# EAGLE design 3_main_a (EAGLE 6.4)
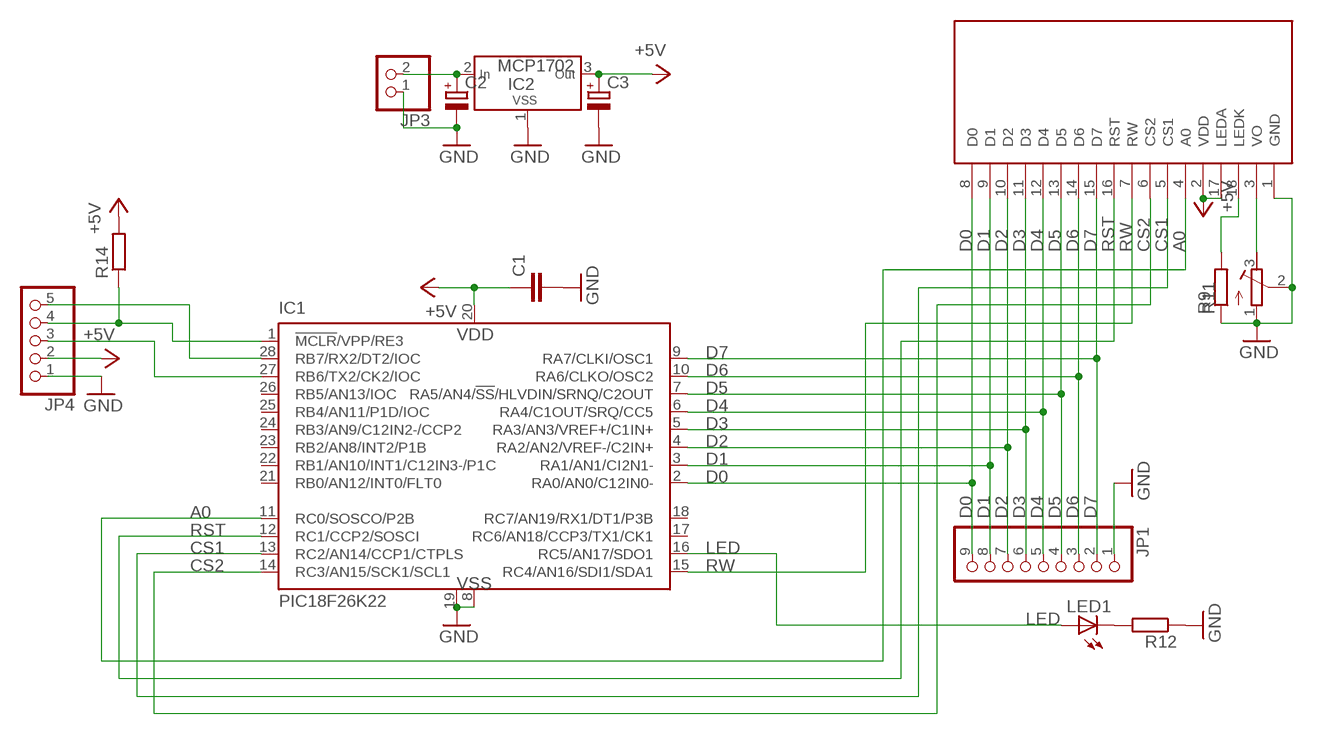
[diagram p0: schematic, sheet 1]

## Parts
C1  C-EU025-025X050  [C025-025X050]
C2  CPOL-EUE2-4  [E2-4]
C3  CPOL-EUE2-4  [E2-4]
IC1  PIC18F26K22  [DIL28-3]
IC2  MCP1702  [TO-92]
JP1  PINHD-1X09_2.54-90°  [1X09/90]
JP3  PINHD-1X2  [1X02]
JP4  PINHD-1X05_2.54-90°  [1X05/90]
LCD1  DEM122032  [DEM122032]
LED1  LED3MM  [LED3MM]
R9  R_0207  [R_0207_BIGPADS]
R11  R-TRIMM3339P  [RTRIM3339P]
R12  R_0207  [R_0207_BIGPADS]
R14  R_0207  [R_0207_BIGPADS]

## Nets
+5V: C1.1 C3.+ IC1.20(VDD) IC2.3(OUT) JP4.2 LCD1.2(VDD) LCD1.17(LEDA) R14.P$2
A0: IC1.11(RC0/SOSCO/P2B) LCD1.4(A0)
CS1: IC1.13(RC2/AN14/CCP1/CTPLS) LCD1.5(CS1)
CS2: IC1.14(RC3/AN15/SCK1/SCL1) LCD1.6(CS2)
D0: IC1.2(RA0/AN0/C12IN0-) JP1.9 LCD1.8(D0)
D1: IC1.3(RA1/AN1/CI2N1-) JP1.8 LCD1.9(D1)
D2: IC1.4(RA2/AN2/VREF-/C2IN+) JP1.7 LCD1.10(D2)
D3: IC1.5(RA3/AN3/VREF+/C1IN+) JP1.6 LCD1.11(D3)
D4: IC1.6(RA4/C1OUT/SRQ/CC5) JP1.5 LCD1.12(D4)
D5: IC1.7(RA5/AN4/!SS!/HLVDIN/SRNQ/C2OUT) JP1.4 LCD1.13(D5)
D6: IC1.10(RA6/CLKO/OSC2) JP1.3 LCD1.14(D6)
D7: IC1.9(RA7/CLKI/OSC1) JP1.2 LCD1.15(D7)
GND: C1.2 C2.- C3.- IC1.8(VSS) IC1.19(VSS) IC2.1(VSS) JP1.1 JP3.1 JP4.1 LCD1.1(GND) R9.P$1 R11.1(E) R11.2(S) R12.P$1
LED: IC1.16(RC5/AN17/SDO1) LED1.A
N$36: LCD1.18(LEDK) R9.P$2
N$37: LCD1.3(VO) R11.3(A)
N$40: LED1.K(C) R12.P$2
N$44: C2.+ IC2.2(IN) JP3.2
N$47: IC1.1(!MCLR!/VPP/RE3) JP4.4 R14.P$1
N$48: IC1.28(RB7/RX2/DT2/IOC) JP4.5
N$49: IC1.27(RB6/TX2/CK2/IOC) JP4.3
RST: IC1.12(RC1/CCP2/SOSCI) LCD1.16(RST)
RW: IC1.15(RC4/AN16/SDI1/SDA1) LCD1.7(RW)
Unconnected: IC1.17(RC6/AN18/CCP3/TX1/CK1) IC1.18(RC7/AN19/RX1/DT1/P3B) IC1.21(RB0/AN12/INT0/FLT0) IC1.22(RB1/AN10/INT1/C12IN3-/P1C) IC1.23(RB2/AN8/INT2/P1B) IC1.24(RB3/AN9/C12IN2-/CCP2) IC1.25(RB4/AN11/P1D/IOC) IC1.26(RB5/AN13/IOC)

## Library data of the parts
C1 = _rcl:C-EU: CAPACITOR, European symbol
C2 C3 = _rcl:CPOL-EU: POLARIZED CAPACITOR, European symbol
IC1 = _mcom5:PIC18F26K22
IC2 = _mcom5:MCP1702
JP1 = pinhead-2:PINHD-1X09: PIN HEADER
JP3 = pinhead:PINHD-1X2: PIN HEADER
JP4 = pinhead-2:PINHD-1X05: PIN HEADER
LCD1 = _mcom6:DEM122032
LED1 = led:LED: LED OSRAM: - CHIPLED LG R971, LG N971, LY N971, LG Q971, LY Q971, LO R971, LY R971 LH N974, LH R974 LS Q976, LO Q976, LY Q976 LO Q996 - Hyper CHIPLED LW Q18S LB Q993, LB Q99A, LB R99A - SideLED LS A670, LO A670, LY A670, LG A670, LP A670 LB A673, LV A673, LT A673, LW A673 LH A674 LY A675 LS A676, LA A676, LO A676, LY A676, LW A676 LS A679, LY A679, LG A679 - Hyper Micro SIDELED® LS Y876, LA Y876, LO Y876, LY Y876 LT Y87S - SmartLED LW L88C, LW L88S LB L89C, LB L89S, LG L890 LS L89K, LO L89K, LY L89K LS L896, LA L896, LO L896, LY L896 - TOPLED LS T670, LO T670, LY T670, LG T670, LP T670 LSG T670, LSP T670, LSY T670, LOP T670, LYG T670 LG T671, LOG T671, LSG T671 LB T673, LV T673, LT T673, LW T673 LH T674 LS T676, LA T676, LO T676, LY T676, LB T676, LH T676, LSB T676, LW T676 LB T67C, LV T67C, LT T67C, LS T67K, LO T67K, LY T67K, LW E67C LS E67B, LA E67B, LO E67B, LY E67B, LB E67C, LV E67C, LT E67C LW T67C LS T679, LY T679, LG T679 LS T770, LO T770, LY T770, LG T770, LP T770 LB T773, LV T773, LT T773, LW T773 LH T774 LS E675, LA E675, LY E675, LS T675 LS T776, LA T776, LO T776, LY T776, LB T776 LHGB T686 LT T68C, LB T68C - Hyper Mini TOPLED® LB M676 - Mini TOPLED Santana® LG M470 LS M47K, LO M47K, LY M47K Source: http://www.osram.convergy.de LUXEON: - LUMILED® LXK2-PW12-R00, LXK2-PW12-S00, LXK2-PW14-U00, LXK2-PW14-V00 LXK2-PM12-R00, LXK2-PM12-S00, LXK2-PM14-U00 LXK2-PE12-Q00, LXK2-PE12-R00, LXK2-PE12-S00, LXK2-PE14-T00, LXK2-PE14-U00 LXK2-PB12-K00, LXK2-PB12-L00, LXK2-PB12-M00, LXK2-PB14-N00, LXK2-PB14-P00, LXK2-PB14-Q00 LXK2-PR12-L00, LXK2-PR12-M00, LXK2-PR14-Q00, LXK2-PR14-R00 LXK2-PD12-Q00, LXK2-PD12-R00, LXK2-PD12-S00 LXK2-PH12-R00, LXK2-PH12-S00 LXK2-PL12-P00, LXK2-PL12-Q00, LXK2-PL12-R00 Source: www.luxeon.com KINGBRIGHT: KA-3528ASYC Source: www.kingbright.com
R9 R12 R14 = _moja:R
R11 = _rcl:R-TRIMM: Trimm resistor

## Board
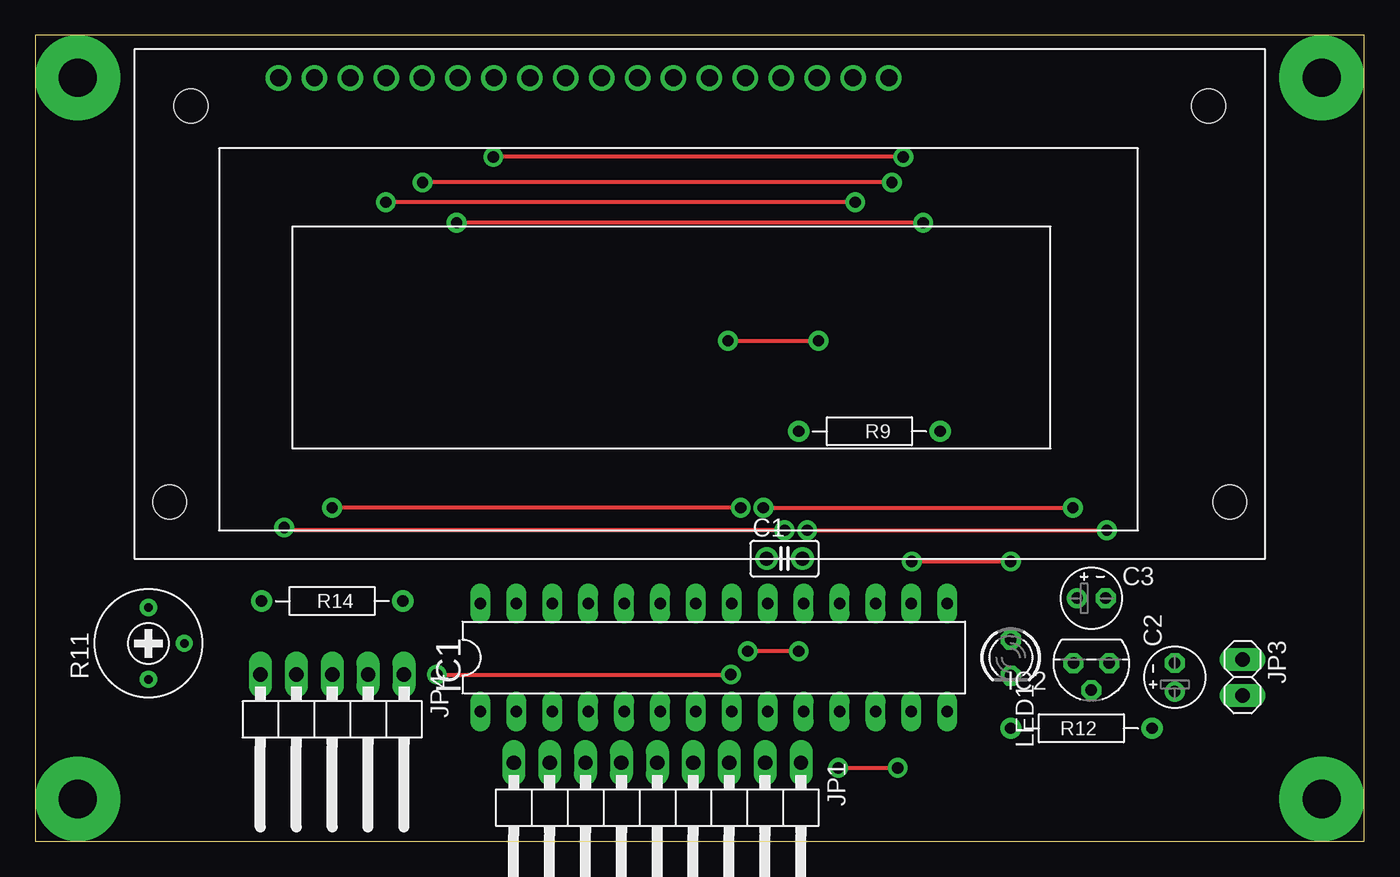
[diagram p1: board, top side]
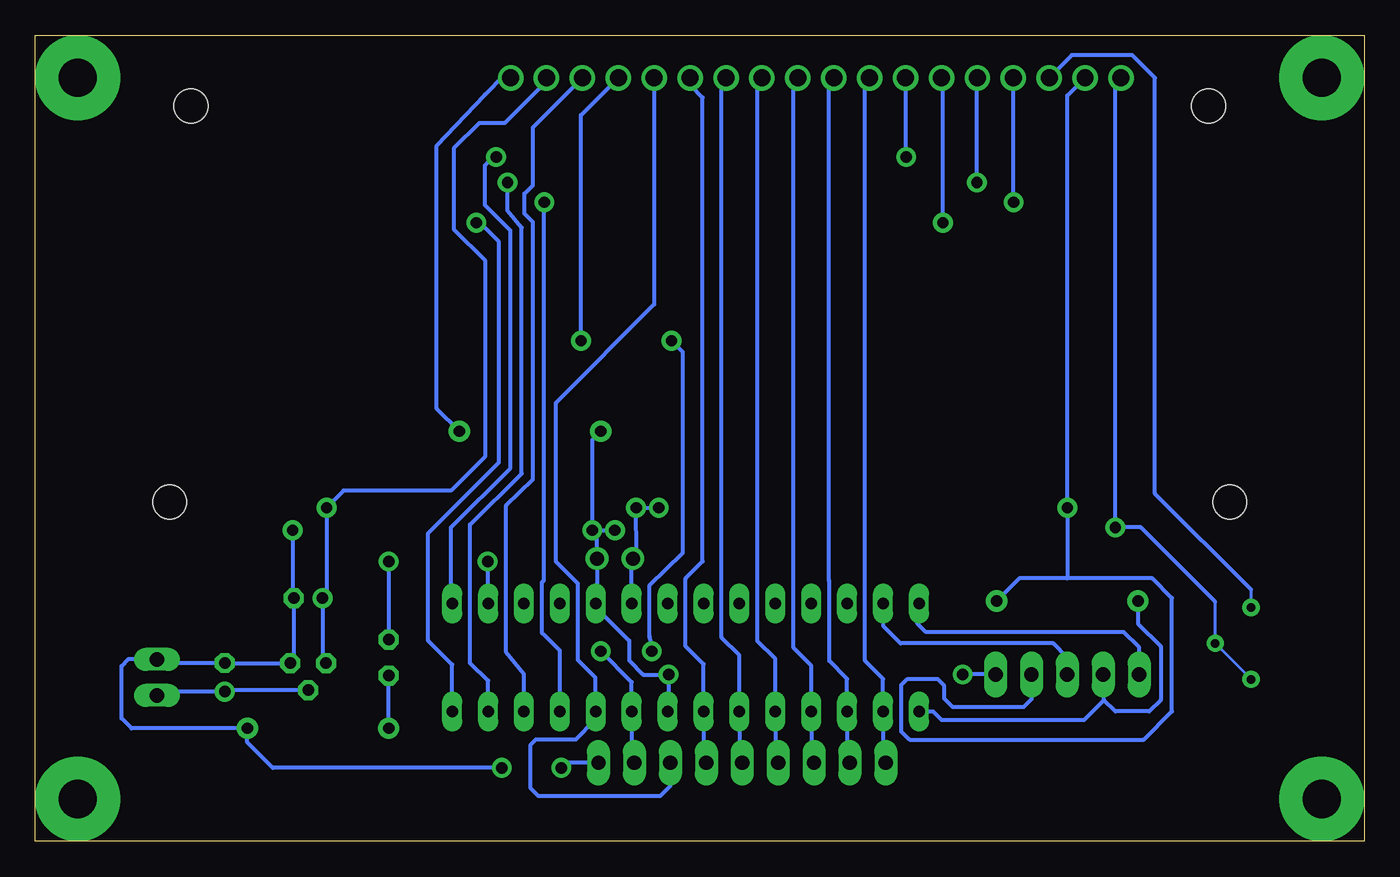
[diagram p2: board, bottom side, seen from below]

Size 94 x 57 mm. Coordinates in mm from the lower left corner, seen from the top.
Outline: 0,57 0,0 94,0 94,57 0,57
Copper layers (1*16): Top 0.035mm / dielectric 1.5mm / Bottom 0.035mm
Design rules "boris_freza": minimum track width 0.2mm, minimum drill 0.4mm, track to track 0.4mm, track to pad 0.4mm, pad to pad 0.4mm, via to via 0.4mm, smd to smd 0.25mm, copper to edge 10mil, drill to drill 8mil, minimum pad ring 0.3mm, minimum via ring 0.3mm, stop-mask expansion 4mil, vias tented up to drill 0mil, thermal gap 10mil

### Footprints (pad centres in the part's own frame; a part is rotated, then mirrored left to right if it is on the bottom)
C025-025X050 = drill 1 pad 1.6: 1 -1.27,0; 2 1.27,0
E2-4 = drill 0.813 pad 1.27: + -1.016,0 | drill 0.813 pad 1.27 octagon: - 1.016,0
DIL28-3 = drill 0.813 long: 1 -16.51,-3.81; 2 -13.97,-3.81; 3 -11.43,-3.81; 4 -8.89,-3.81; 5 -6.35,-3.81; 6 -3.81,-3.81; 7 -1.27,-3.81; 8 1.27,-3.81; 9 3.81,-3.81; 10 6.35,-3.81; 11 8.89,-3.81; 12 11.43,-3.81; 13 13.97,-3.81; 14 16.51,-3.81; 15 16.51,3.81; 16 13.97,3.81; 17 11.43,3.81; 18 8.89,3.81; 19 6.35,3.81; 20 3.81,3.81; 21 1.27,3.81; 22 -1.27,3.81; 23 -3.81,3.81; 24 -6.35,3.81; 25 -8.89,3.81; 26 -11.43,3.81; 27 -13.97,3.81; 28 -16.51,3.81
TO-92 = drill 0.813 octagon: 1 -1.27,0; 2 0,1.905; 3 1.27,0
1X09/90 = drill 1.016 long: 1 -10.16,-3.81; 2 -7.62,-3.81; 3 -5.08,-3.81; 4 -2.54,-3.81; 5 0,-3.81; 6 2.54,-3.81; 7 5.08,-3.81; 8 7.62,-3.81; 9 10.16,-3.81
1X02 = drill 1.016 long: 1 -1.27,0; 2 1.27,0
1X05/90 = drill 1.016 long: 1 -5.08,-3.81; 2 -2.54,-3.81; 3 0,-3.81; 4 2.54,-3.81; 5 5.08,-3.81
DEM122032 = drill 1.2: 1 10.2,34; 2 12.74,34; 3 15.28,34; 4 17.82,34; 5 20.36,34; 6 22.9,34; 7 25.44,34; 8 27.98,34; 9 30.52,34; 10 33.06,34; 11 35.6,34; 12 38.14,34; 13 40.68,34; 14 43.22,34; 15 45.76,34; 16 48.3,34; 17 50.84,34; 18 53.38,34 | hole 2.4: 2.5,4; 77.5,4; 4,32; 76,32
LED3MM = drill 0.813 octagon: A -1.27,0; K 1.27,0
R_0207_BIGPADS = drill 0.8 pad 1.5: P$1 5,0; P$2 -5,0
RTRIM3339P = drill 0.61: 1 -2.54,0; 2 0,-2.54; 3 2.54,0

### Placement (x,y rotation side)
C1  53,20 0 top
C2  80.6,11.6 90 top
C3  74.7,17.2 0 top
IC1  48,13 0 top
IC2  74.7,12.6 180 top
JP1  44,1.75 180 top
JP3  85.4,11.6 270 top
JP4  21,8 180 top
LCD1  7,20 0 top
LED1  69,13 270 top
R9  59,29 180 top
R11  8,14 90 top
R12  74,8 0 top
R14  21,17 180 top

### Tracks (layer width: path | path; a pad name or v marks a point on that pad's centre or on a via)
+5V  (via drill 0.8)
  Top 0.3: v51.5,23.6 v73.4,23.6 | v49.9,23.6 v21,23.6
  Bottom 0.3: IC1.20 51.81,19.92 C1.1 51.48,20.33 v51.5,23.6 v49.9,23.6 | IC2.3 73.68,12.85 C3.+ 73.4,17.48 v73.4,23.6 72.2,24.8 64.6,24.8 62.2,27.2 62.2,41.1 64.4,43.3 64.4,49 62.6,50.8 60.8,50.8 57.84,53.76 LCD1.17 | LCD1.2 21,52.74 v21,23.6 21,18.6 | JP4.2 23.54,10.06 24.1,9.5 29.1,9.5 29.7,10.1 29.7,11 30.2,11.5 32.3,11.5 32.76,11.04 32.76,7.8 32.16,7.2 15.6,7.2 13.6,9.2 13.6,17.2 15,18.6 21,18.6 | 21,18.6 24.4,18.6 R14.P$2
A0  (via drill 0.8)
  Top 0.3: v58,45.2 v24.8,45.2
  Bottom 0.3: IC1.11 56.89,13.49 58,14.6 58.01,14.6 58.15,14.72 58.15,18.35 58.02,18.44 v58,45.2 | v24.8,45.2 24.8,53.98 LCD1.4
CS1  (via drill 0.8)
  Top 0.3: v60.6,46.6 v27.4,46.6
  Bottom 0.3: IC1.13 61.97,11.37 63.25,12.6 63.25,22.4 59.6,26 59.6,43.4 60.6,44.6 v60.6,46.6 | v27.4,46.6 27.4,53.96 LCD1.5
CS2  (via drill 0.8)
  Top 0.3: v62.8,43.75 v29.8,43.75
  Bottom 0.3: IC1.14 64.51,12.51 66.2,14.2 66.2,21.8 61.2,26.8 61.2,42.4 62.2,43.4 v62.8,43.75 | v29.8,43.75 29.8,53.9 LCD1.6
D0
  Bottom 0.3: JP1.9 34.03,6 IC1.2 34.03,11.5 35.31,12.78 35.31,53.67 LCD1.8
D1
  Bottom 0.3: JP1.8 36.57,6 IC1.3 36.57,11.49 37.84,12.76 37.84,18.36 37.86,18.45 37.86,53.66 LCD1.9
D2
  Bottom 0.3: JP1.7 39.11,6 IC1.4 39.11,12.42 40.37,13.68 40.37,53.69 LCD1.10
D3
  Bottom 0.3: JP1.6 41.65,6 IC1.5 41.65,12.9 42.92,14.17 42.92,53.68 LCD1.11
D4
  Bottom 0.3: JP1.5 44.19,6 IC1.6 44.19,13.15 45.45,14.41 45.45,53.69 LCD1.12
D5
  Bottom 0.3: LCD1.13 47.8,53.68 47.6,53.4 46.8,52.6 46.8,19.8 48,18.6 48,13.8 46.73,12.53 IC1.7 46.73,6 JP1.4
D6
  Bottom 0.3: LCD1.14 50.22,37.98 57.2,31 57.2,19.8 55.63,18.24 55.63,12.84 54.4,11.6 54.4,9.24 IC1.10 54.4,9.14 54.4,8.6 55.8,7.2 58.6,7.2 59,6.8 59,3.8 58.4,3.2 49.8,3.2 49.08,3.92 JP1.3
D7  (via drill 0.8)
  Top 0.3: v54,13.45 v50.4,13.45 | v49,35.4 v55.4,35.4
  Bottom 0.3: JP1.2 51.81,6 IC1.9 51.81,11.26 v54,13.45 | v50.4,13.45 50.4,14.06 50.55,14.49 50.55,18.13 48.2,20.4 48.2,34.6 v49,35.4 | v55.4,35.4 55.4,51.36 LCD1.15
GND  (via drill 0.8)
  Top 0.3: v54.6,22 v75.8,22 | v53,22 17.8,22 v17.6,22.2 | v28.4,11.8 v49.2,11.8 | v56.8,5.2 v61,5.2
  Bottom 0.2: 10.54,16.94 R11.2 R11.1
  Bottom 0.3: IC1.8 49.27,9.8 | 49.27,9.8 49.27,9.87 | v75.8,22 75.8,17.28 C3.- 75.72,12.85 IC2.1 75.99,12.62 C2.- 85.15,12.62 JP3.1 85.43,12.9 87.4,12.9 87.9,12.4 87.9,8.7 87.2,8 R12.P$1 79,7 77.2,5.2 v61,5.2 | v54.6,22 54.6,28.4 R9.P$1 | v54.6,22 v53,22 | v54.6,22 54.27,21.67 C1.2 54.27,16.89 IC1.19 54.4,16.76 54.4,16.6 52,14.2 52,12.8 51,11.8 v49.2,11.8 49.2,9.87 49.27,9.8 | LCD1.1 17.6,53.6 v17.6,22.2 15.8,22.2 10.54,16.94 | JP4.1 28.19,11.81 v28.4,11.8 | JP1.1 56.44,5.56 v56.8,5.2
LED  (via drill 0.8)
  Top 0.3: v62,19.8 v69,19.8
  Bottom 0.3: IC1.16 61.97,19.77 v62,19.8 | v69,19.8 LED1.A
N$1  (via drill 2.7 pad 6)
  other vias: 3,54
N$2  (via drill 2.7 pad 6)
  other vias: 91,54
N$3  (via drill 2.7 pad 6)
  other vias: 91,3
N$4  (via drill 2.7 pad 6)
  other vias: 3,3
N$36
  Bottom 0.3: R9.P$2 65.6,30.6 65.6,49.2 62.2,52.8 60.8,54.2 60.58,54.2 LCD1.18
N$37
  Bottom 0.2: R11.3 8,17.8
  Bottom 0.3: 8,17.8 14.8,24.6 14.8,54 16.4,55.6 20.68,55.6 LCD1.3
N$40
  Bottom 0.3: R12.P$2 LED1.K
N$44
  Bottom 0.3: IC2.2 80.49,10.7 C2.+ 85.15,10.58 JP3.2
N$47
  Bottom 0.3: IC1.1 30.5,9.2 29.9,8.6 19.8,8.6 18.4,10 | 18.4,10 18.4,11.75 JP4.4 | R14.P$1 16,15.4 14.4,13.8 14.4,10 15.2,9.2 17.6,9.2 18.4,10
N$48
  Bottom 0.3: JP4.5 15.92,13.72 17,14.8 31,14.8 31.6,15.4 31.6,16.7 IC1.28
N$49
  Bottom 0.3: JP4.3 21,13 22,14 32.8,14 34,15.2 34,16.78 IC1.27
RST
  Bottom 0.3: IC1.12 59.43,11.83 60.69,13.36 60.69,23.76 58.8,25.6 58.8,43.8 59.4,44.4 59.4,45.8 58.8,46.4 58.8,50.5 LCD1.16
RW  (via drill 0.8)
  Top 0.3: v61.4,48.4 v32.4,48.4
  Bottom 0.3: IC1.15 64.51,17.31 64.6,17.4 64.6,22.2 60.4,26.4 60.4,43.2 62.2,45 62.2,47.8 61.6,48.4 v61.4,48.4 | v32.4,48.4 32.4,53.96 LCD1.7